# Altium schematic sheet SubPowersupply.SchDoc
size A4
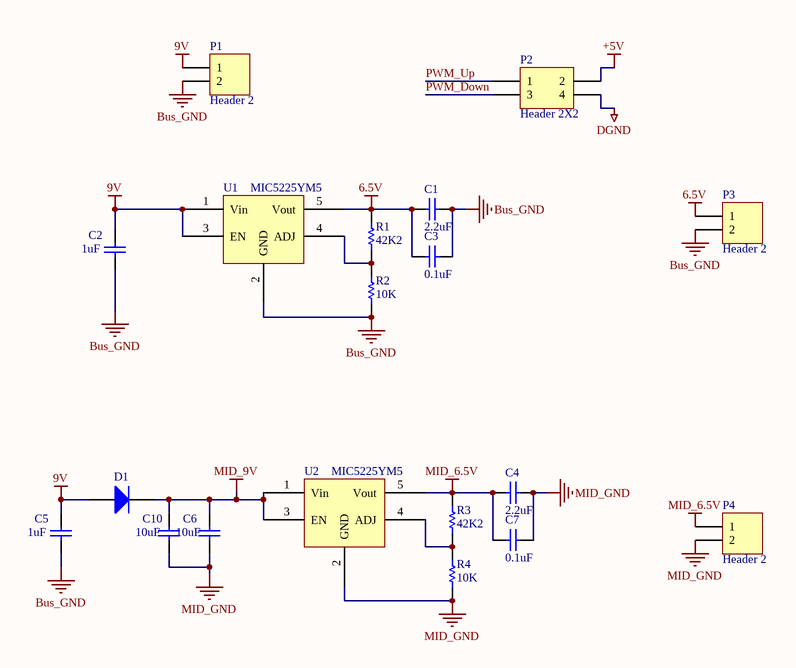
[diagram p0: SubPowersupply.SchDoc]

## Parts
C1  2.2uF  [0603_C]
C2  1uF  [0603_C]
C3  0.1uF  [0603_C]
C4  2.2uF  [0603_C]
C5  1uF  [0603_C]
C6  10uF  [0603_C]
C7  0.1uF  [0603_C]
C10  10uF  [0603_C]
D1  Diode  [SMA]  (value not drawn)
P1  Header 2  [HDR1X2]
P2  Header 2X2  [HDR2X2]
P3  Header 2  [HDR1X2]
P4  Header 2  [HDR1X2]
R1  42K2  [0603_R]
R2  10K  [0603_R]
R3  42K2  [0603_R]
R4  10K  [0603_R]
U1  MIC5225YM5  [SOT23-5]
U2  MIC5225YM5  [SOT23-5]

## Nets
6.5V: C1.2 C3.2 P3.1 R1.2 U1.5(Vout)
9V: C2.2 C5.2 D1.1(A) P1.1 U1.1(Vin) U1.3(EN)
+5V: P2.2
Bus_GND: C1.1 C2.1 C3.1 C5.1 P1.2 P3.2 R2.1 U1.2(GND)
DGND: P2.4
MID_6.5V: C4.2 C7.2 P4.1 R3.2 U2.5(Vout)
MID_9V: C6.2 C10.2 D1.2(K) U2.1(Vin) U2.3(EN)
MID_GND: C4.1 C6.1 C7.1 C10.1 P4.2 R4.1 U2.2(GND)
PWM_Down: P2.3
PWM_Up: P2.1
NetR1_1: R1.1 R2.2 U1.4(ADJ)
NetR3_1: R3.1 R4.2 U2.4(ADJ)

## Library data of the parts
C1-C7 C10 = Cap: Capacitor; Manufacturer: Generic Components; Class: Passive; Value: 100pF; Published: 08/06/2000; Publisher: Altium Hobart Technology Centre; SubClass: Capacitor
D1 = Diode: Default Diode; Published: 8-Jun-2000; LatestRevisionDate: 17-Jul-2002; LatestRevisionNote: Re-released for DXP Platform.; PackageDocument: Sep-1996; PackageReference: SMC; Publisher: Altium Limited; Code_JEDEC: DO-214-AB
P1 P3 P4 = Header 2: Header, 2-Pin; LatestRevisionDate: 17-Jul-2002; LatestRevisionNote: Re-released for DXP Platform.; Publisher: Altium Limited
P2 = Header 2X2: Header, 2-Pin, Dual row; LatestRevisionDate: 17-Jul-2002; LatestRevisionNote: Re-released for DXP Platform.; Publisher: Altium Limited
R1-R4 = Res Semi: Semiconductor Resistor; Published: 8-Jun-2000; LatestRevisionDate: 17-Jul-2002; LatestRevisionNote: Re-released for DXP Platform.; PackageReference: AXIAL-0.5; Publisher: Altium Limited
  R1 R3: Value: 42K2
  R2 R4: Value: 10K